# EAGLE board v.0.0.0 (EAGLE 5.11)
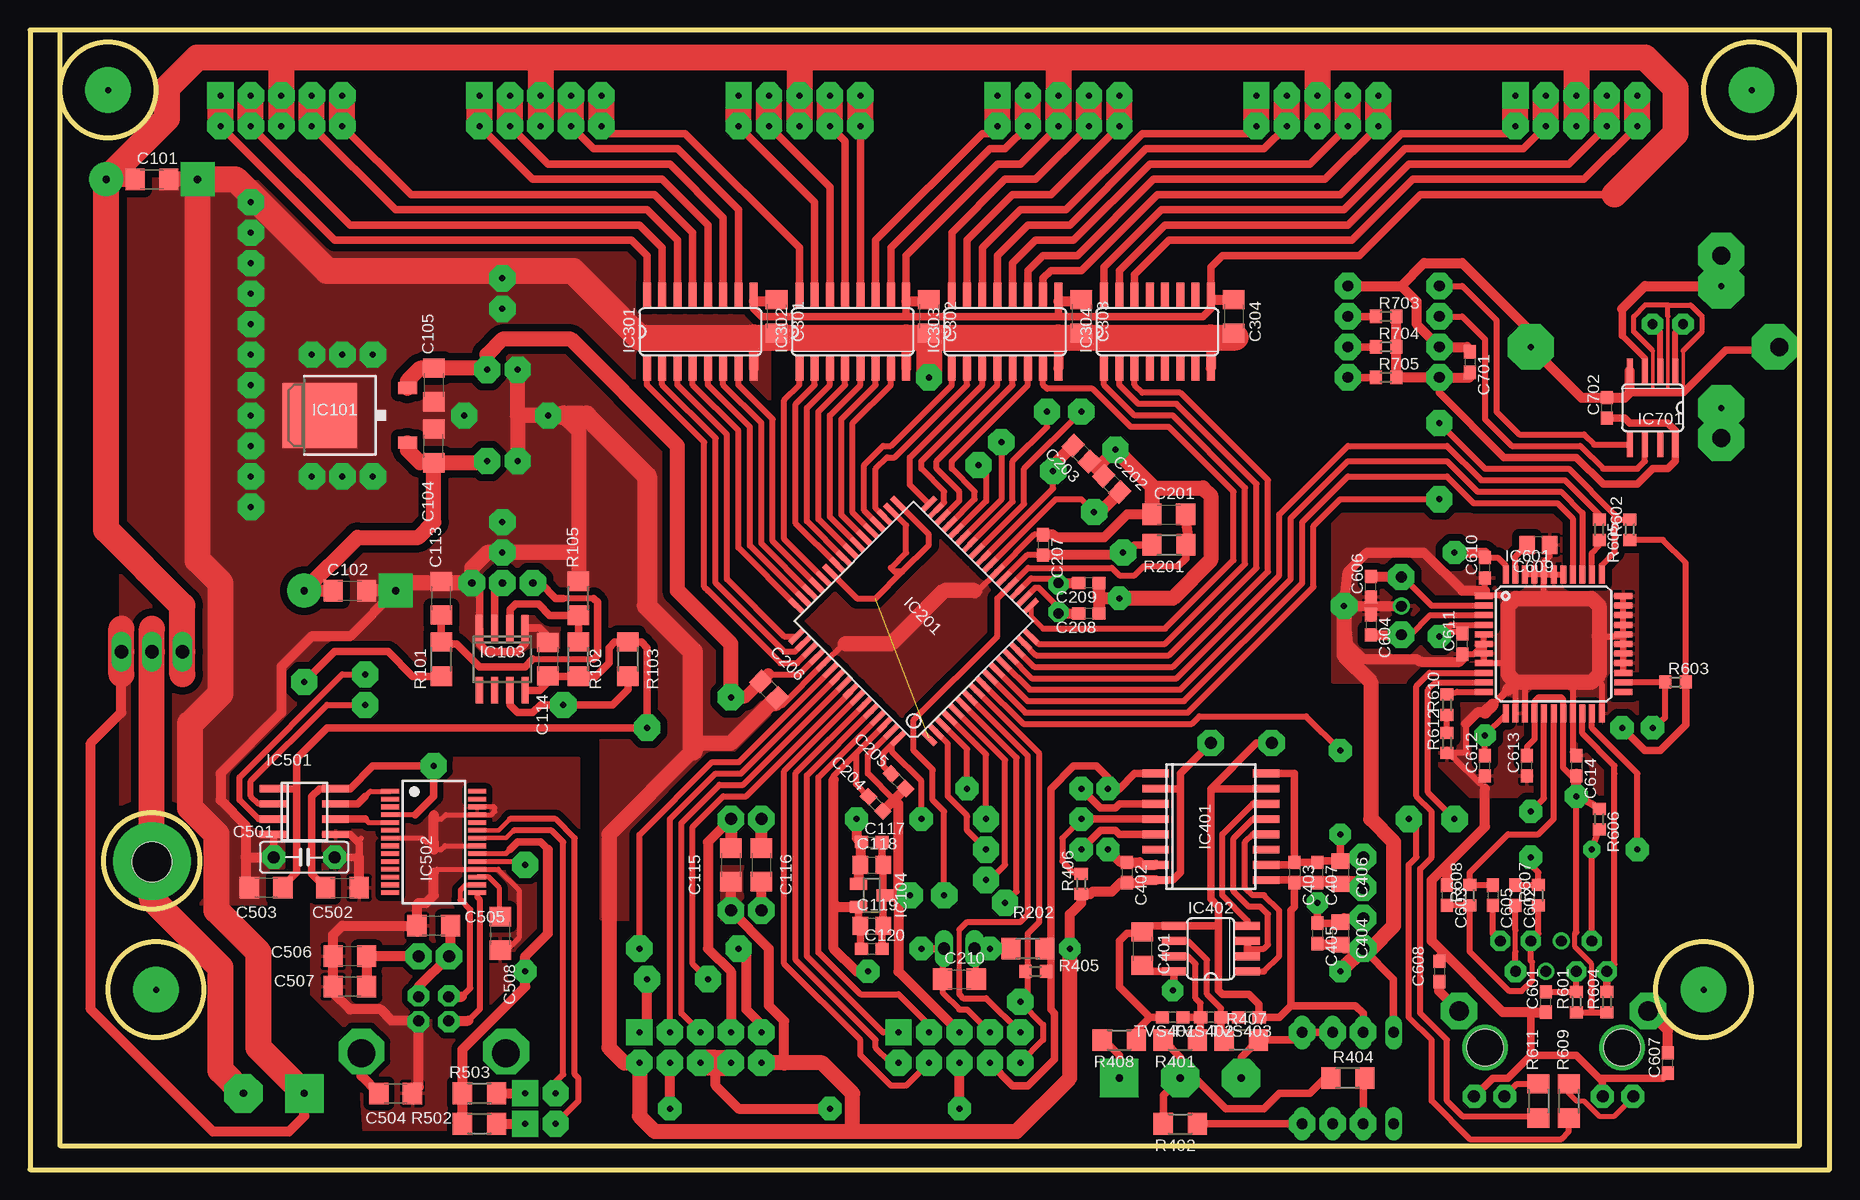
[diagram p7: board, top side]
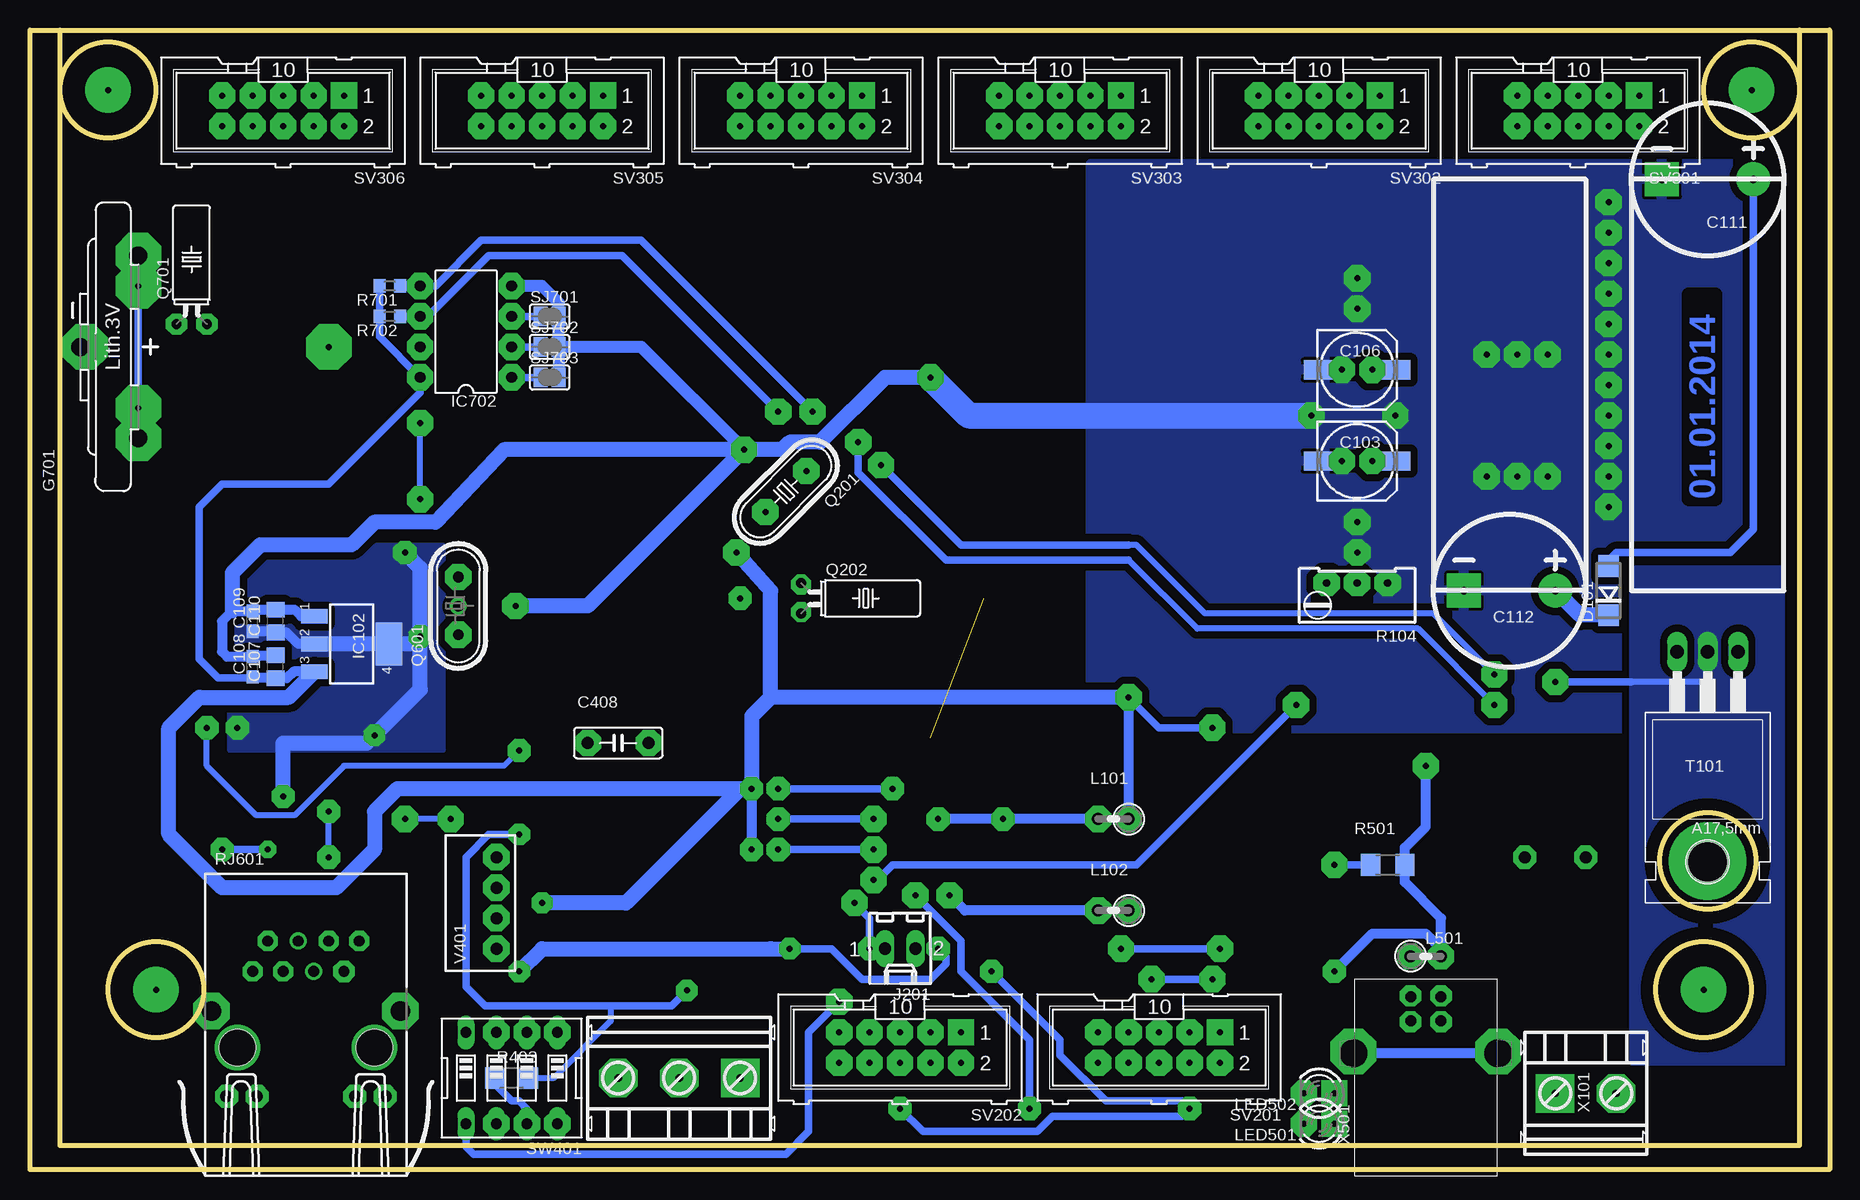
[diagram p8: board, bottom side, seen from below]

Size 150 x 95 mm. Coordinates in mm from the lower left corner, seen from the top.
Outline: 147.5,95 150,95 150,0 0,0 0,95 2.5,95
Outline: 147.5,95 2.5,95
Outline: 2.5,95 2.5,2 147.5,2 147.5,95
Outline: circle at 10.5,15 radius 4
Outline: circle at 139.5,15 radius 4
Outline: circle at 6.5,90 radius 4
Outline: circle at 143.5,90 radius 4
Outline: circle at 10.16,25.72 radius 4
Copper layers (1*16): Top 0.035mm / dielectric 1.5mm / Bottom 0.035mm
Design rules "default *": minimum track width 10mil, minimum drill 19mil, track to track 8mil, track to pad 8mil, pad to pad 8mil, via to via 8mil, smd to smd 8mil, copper to edge 40mil, drill to drill 8mil, minimum pad ring 10mil, minimum via ring 8mil, stop-mask expansion 4mil, vias tented up to drill 0mil, thermal gap 10mil
bRestrict: area 2,92 to 8,98; area 2,2 to 8,8

## Footprints (pad centres in the part's own frame; a part is rotated, then mirrored left to right if it is on the bottom)
C1206 = smd 1.6 x 1.8: 1 -1.4,0; 2 1.4,0
153CLV-0605 = smd 3.5 x 1.6: + 2.7,0; - -2.7,0
C0805 = smd 1.3 x 1.5: 1 -0.95,0; 2 0.95,0
C0603 = smd 1.1 x 1: 1 -0.85,0; 2 0.85,0
CP300X100X24 = drill 0.61 pad 2.819 round: + -3.81,0 | drill 0.61 pad 2.819 square: - 3.81,0
C050-025X075 = drill 1 octagon: 1 -2.54,0; 2 2.54,0
DO214AC = smd 1.8 x 1.7: A 2.05,0; C -2.05,0
CR2325/1VG = drill 1.5 pad 3.15 octagon: + 7.62,-1.27; +@1 -7.62,-1.27; - 0,3.556
TO252 = smd 1 x 1.6: 1 -2.28,-4.8; 2 2.28,-4.8 | smd 5.4 x 6.2: 3 0,2.5
SOT223 = smd 1.219 x 2.235: 1 -2.311,-3.099; 2 0,-3.099; 3 2.311,-3.099 | smd 3.6 x 2.2: 4 0,3.099
SO08 = smd 0.6 x 2.2: 1 -1.905,-2.6; 2 -0.635,-2.6; 3 0.635,-2.6; 4 1.905,-2.6; 5 1.905,2.6; 6 0.635,2.6; 7 -0.635,2.6; 8 -1.905,2.6
SOT23 = smd 1 x 1.4: 1 -0.95,-1.1; 2 0.95,-1.1; 3 0,1.1
TQFP64-HOME = smd 1.524 x 0.457: 1 -7.8,6; 2 -7.8,5.2; 3 -7.8,4.4; 4 -7.8,3.6; 5 -7.8,2.8; 6 -7.8,2; 7 -7.8,1.2; 8 -7.8,0.4; 9 -7.8,-0.4; 10 -7.8,-1.2; 11 -7.8,-2; 12 -7.8,-2.8; 13 -7.8,-3.6; 14 -7.8,-4.4; 15 -7.8,-5.2; 16 -7.8,-6; 33 7.8,-6; 34 7.8,-5.2; 35 7.8,-4.4; 36 7.8,-3.6; 37 7.8,-2.8; 38 7.8,-2; 39 7.8,-1.2; 40 7.8,-0.4; 41 7.8,0.4; 42 7.8,1.2; 43 7.8,2; 44 7.8,2.8; 45 7.8,3.6; 46 7.8,4.4; 47 7.8,5.2; 48 7.8,6 | smd 0.457 x 1.524: 17 -6,-7.8; 18 -5.2,-7.8; 19 -4.4,-7.8; 20 -3.6,-7.8; 21 -2.8,-7.8; 22 -2,-7.8; 23 -1.2,-7.8; 24 -0.4,-7.8; 25 0.4,-7.8; 26 1.2,-7.8; 27 2,-7.8; 28 2.8,-7.8; 29 3.6,-7.8; 30 4.4,-7.8; 31 5.2,-7.8; 32 6,-7.8; 49 6,7.8; 50 5.2,7.8; 51 4.4,7.8; 52 3.6,7.8; 53 2.8,7.8; 54 2,7.8; 55 1.2,7.8; 56 0.4,7.8; 57 -0.4,7.8; 58 -1.2,7.8; 59 -2,7.8; 60 -2.8,7.8; 61 -3.6,7.8; 62 -4.4,7.8; 63 -5.2,7.8; 64 -6,7.8
SO16 = smd 0.66 x 2.032: 1 -4.445,-3.073; 2 -3.175,-3.073; 3 -1.905,-3.073; 4 -0.635,-3.073; 5 0.635,-3.073; 6 1.905,-3.073; 7 3.175,-3.073; 8 4.445,-3.073; 9 4.445,3.073; 10 3.175,3.073; 11 1.905,3.073; 12 0.635,3.073; 13 -0.635,3.073; 14 -1.905,3.073; 15 -3.175,3.073; 16 -4.445,3.073
SO-16W = smd 0.635 x 2.2: 1 -4.445,-4.6; 2 -3.175,-4.6; 3 -1.905,-4.6; 4 -0.635,-4.6; 5 0.635,-4.6; 6 1.905,-4.6; 7 3.175,-4.6; 8 4.445,-4.6; 9 4.445,4.6; 10 3.175,4.6; 11 1.905,4.6; 12 0.635,4.6; 13 -0.635,4.6; 14 -1.905,4.6; 15 -3.175,4.6; 16 -4.445,4.6
SO08' = smd 0.66 x 2.032: 1 -1.905,-3.073; 2 -0.635,-3.073; 3 0.635,-3.073; 4 1.905,-3.073; 5 1.905,3.073; 6 0.635,3.073; 7 -0.635,3.073; 8 -1.905,3.073
SO8 = smd 0.6 x 2.2: 1 -1.905,-2.6; 2 -0.635,-2.6; 3 0.635,-2.6; 4 1.905,-2.6; 5 1.905,2.6; 6 0.635,2.6; 7 -0.635,2.6; 8 -1.905,2.6
SSOP28 = smd 0.381 x 1.499: 1 -4.225,-3.625; 2 -3.575,-3.625; 3 -2.925,-3.625; 4 -2.275,-3.625; 5 -1.625,-3.625; 6 -0.975,-3.625; 7 -0.325,-3.625; 8 0.325,-3.625; 9 0.975,-3.625; 10 1.625,-3.625; 11 2.275,-3.625; 12 2.925,-3.625; 13 3.575,-3.625; 14 4.225,-3.625; 15 4.225,3.625; 16 3.575,3.625; 17 2.925,3.625; 18 2.275,3.625; 19 1.625,3.625; 20 0.975,3.625; 21 0.325,3.625; 22 -0.325,3.625; 23 -0.975,3.625; 24 -1.625,3.625; 25 -2.275,3.625; 26 -2.925,3.625; 27 -3.575,3.625; 28 -4.225,3.625
TQFP44 = smd 1.5 x 0.5: 1 -5.8,4; 2 -5.8,3.2; 3 -5.8,2.4; 4 -5.8,1.6; 5 -5.8,0.8; 6 -5.8,0; 7 -5.8,-0.8; 8 -5.8,-1.6; 9 -5.8,-2.4; 10 -5.8,-3.2; 11 -5.8,-4; 23 5.8,-4; 24 5.8,-3.2; 25 5.8,-2.4; 26 5.8,-1.6; 27 5.8,-0.8; 28 5.8,0; 29 5.8,0.8; 30 5.8,1.6; 31 5.8,2.4; 32 5.8,3.2; 33 5.8,4 | smd 0.5 x 1.5: 12 -4,-5.8; 13 -3.2,-5.8; 14 -2.4,-5.8; 15 -1.6,-5.8; 16 -0.8,-5.8; 17 0,-5.8; 18 0.8,-5.8; 19 1.6,-5.8; 20 2.4,-5.8; 21 3.2,-5.8; 22 4,-5.8; 34 4,5.8; 35 3.2,5.8; 36 2.4,5.8; 37 1.6,5.8; 38 0.8,5.8; 39 0,5.8; 40 -0.8,5.8; 41 -1.6,5.8; 42 -2.4,5.8; 43 -3.2,5.8; 44 -4,5.8
SO8' = smd 0.508 x 2.032: 1 -1.905,-3.073; 2 -0.635,-3.073; 3 0.635,-3.073; 4 1.905,-3.073; 5 1.905,3.073; 6 0.635,3.073; 7 -0.635,3.073; 8 -1.905,3.073
DIL8-NEW = drill 0.9 pad 1.524 square: 1 -3.81,-3.81 | drill 0.9 pad 1.524 octagon: 2 -1.27,-3.81; 3 1.27,-3.81; 4 3.81,-3.81; 5 3.81,3.81; 6 1.27,3.81; 7 -1.27,3.81; 8 -3.81,3.81
6410-02 = drill 1.016 long: 1 1.27,0; 2 -1.27,0
0207/2V@1 = drill 1 octagon: 1 -1.27,0; 2 1.27,0
LED3MM-HOME = drill 0.5 pad 2.184 square: A -1.27,0 | drill 0.5 pad 2.184 octagon: K 1.27,0
HC49/S-HOME = drill 0.5 pad 2.184 octagon: 1 -2.413,0; 2 2.413,0
TC38H = drill 0.813 round: 1 -1.27,0; 2 1.27,0
HC49U = drill 0.9 round: 1 -2.413,0; 2 -0.027,0; 3 2.413,0
R1206 = smd 1.6 x 1.803: 1 -1.422,0; 2 1.422,0
RTRIM64W = drill 0.61 round: 1 1.27,-2.54; 2 1.27,0; 3 1.27,2.54
R0603 = smd 1 x 1.1: 1 -0.85,0; 2 0.85,0
TS8P8C = drill 0.9 round: 1 -4.445,6.35; 2 -3.175,8.89; 3 -1.905,6.35; 4 -0.635,8.89; 5 0.635,6.35; 6 1.905,8.89; 7 3.175,6.35; 8 4.445,8.89 | drill 1 round: 9 -6.63,-4.06; 10 -4.09,-4.06; 11 4.09,-4.06; 12 6.63,-4.06 | drill 1.6 round: M1 -7.875,3.05; M2 7.875,3.05 | hole 3: 5.715,0; -5.715,0
SJ = smd 1.168 x 1.6: 1 -0.762,0; 2 0.762,0
M10-HOME = drill 0.5 pad 2.184 square: 1 -5.08,-1.27 | drill 0.5 pad 2.184 octagon: 2 -5.08,1.27; 3 -2.54,-1.27; 4 -2.54,1.27; 5 0,-1.27; 6 0,1.27; 7 2.54,-1.27; 8 2.54,1.27; 9 5.08,-1.27; 10 5.08,1.27
EDG-04 = drill 0.9 long: 1 -3.81,-3.81; 2 -1.27,-3.81; 3 1.27,-3.81; 4 3.81,-3.81; 5 3.81,3.81; 6 1.27,3.81; 7 -1.27,3.81; 8 -3.81,3.81
TO220 = drill 1.118 long: 1 -2.54,-6.35; 2 0,-6.35; 3 2.54,-6.35 | hole 3.302: 0,11.176
D0603 = smd 1.1 x 1: 1 -0.85,0; 2 0.85,0
TME = drill 1 square: 1 -3.81,0 | drill 1 round: 2 -1.27,0; 3 1.27,0; 4 3.81,0
AWG/2-H = drill 0.61 pad 3.2 square: 1 2.54,0 | drill 0.61 pad 3.2 octagon: 2 -2.54,0
AWG/3-H = drill 0.61 pad 3.2 square: 1 5.08,0 | drill 0.61 pad 3.2 octagon: 2 0,0; 3 -5.08,0
85-32004-00X = drill 0.92 pad 1.27 round: 1 4.71,-1.25; 2 4.71,1.25; 3 2.71,1.25; 4 2.71,-1.25 | drill 2.3 pad 3 round: M1 0,6.02; M2 0,-6.02

## Placement (x,y rotation side)
C101  100nF  [C1206]  10.16,82.55 0 top
C102  100nF  [C1206]  26.67,48.26 0 top
C103  220uF/50V  [153CLV-0605]  39.37,59.05 0 bottom
C104  100nF  [C1206]  33.66,60.33 90 top
C105  100nF  [C1206]  33.66,65.41 270 top
C106  100uF/16V  [153CLV-0605]  39.37,66.67 0 bottom
C107  10uF  [C0805]  129.54,41.91 90 bottom
C108  100nF  [C0603]  131.44,41.91 90 bottom
C109  100nF  [C0603]  131.44,45.72 90 bottom
C110  10uF  [C0805]  129.54,45.72 90 bottom
C111  4700uF/25V  [CP300X100X24]  10.16,82.55 180 bottom
C112  4700uF/25V  [CP300X100X24]  26.67,48.26 180 bottom
C113  100nF  [C1206]  34.29,47.62 90 top
C114  100nF  [C1206]  43.18,42.55 270 top
C115  100nF  [C1206]  58.42,25.4 270 top
C116  100nF  [C1206]  60.96,25.4 270 top
C117  100nF  [C0603]  70.17,27.3 0 top
C118  10uF  [C0805]  70.17,25.4 0 top
C119  10uF  [C0805]  70.17,20.32 0 top
C120  100nF  [C0603]  70.17,18.41 0 top
C201  100nF  [C1206]  94.93,54.61 0 top
C202  22pF  [C0805]  90.17,57.15 315 top
C203  22pF  [C0805]  87.63,59.69 135 top
C204  100nF  [C0603]  70.48,30.48 135 top
C205  100nF  [C0603]  72.39,32.38 135 top
C206  100nF  [C0805]  61.59,40.01 135 top
C207  100nF  [C0603]  84.45,52.07 270 top
C208  NA  [C0603]  88.27,46.35 180 top
C209  NA  [C0603]  88.27,48.9 180 top
C210  100nF  [C1206]  77.47,15.88 0 top
C301  100nF  [C1206]  62.23,71.12 270 top
C302  100nF  [C1206]  74.93,71.12 270 top
C303  100nF  [C1206]  87.63,71.12 270 top
C304  100nF  [C1206]  100.33,71.12 270 top
C401  100nF  [C1206]  92.71,18.41 270 top
C402  100nF  [C0603]  91.44,24.77 270 top
C403  100nF  [C0603]  105.41,24.77 270 top
C404  4.7uF/16V  [C0805]  109.22,19.68 270 top
C405  100nF  [C0603]  107.31,19.68 270 top
C406  10uF  [C0805]  109.22,24.77 270 top
C407  100nF  [C0603]  107.31,24.77 270 top
C408  4.7nF/400V  [C050-025X075]  100.97,35.56 180 bottom
C501  4.7nF/400V  [C050-025X075]  22.86,26.04 0 top
C502  100nF  [C1206]  26.04,23.5 0 top
C503  100nF  [C1206]  19.68,23.5 180 top
C504  10nF  [C1206]  30.48,6.35 0 top
C505  10nF  [C1206]  33.66,20.32 180 top
C506  100nF  [C1206]  26.67,17.78 180 top
C507  4.7uF  [C1206]  26.67,15.24 180 top
C508  100nF  [C1206]  39.19,19.68 270 top
C601  10nF  [C0603]  126.36,13.97 90 top
C602  6.8nF  [C0603]  123.83,22.86 270 top
C603  10nF  [C0603]  118.11,22.86 270 top
C604  20pF  [C0603]  111.76,45.4 270 top
C605  6.8nF  [C0603]  121.92,22.86 270 top
C606  20pF  [C0603]  111.76,48.58 90 top
C607  10nF  [C0603]  136.53,8.89 90 top
C608  10nF  [C0603]  117.47,16.51 270 top
C609  10uF/6.3V  [C0805]  125.73,52.07 180 top
C610  100nF  [C0603]  121.28,50.16 90 top
C611  100nF  [C0603]  119.38,43.81 90 top
C612  100nF  [C0603]  121.28,33.66 90 top
C613  100nF  [C0603]  124.78,33.66 90 top
C614  100nF  [C0603]  128.91,33.66 270 top
C701  100nF  [C0603]  120.02,67.31 270 top
C702  100nF  [C0603]  131.44,63.5 90 top
D101  SS14  [DO214AC]  18.41,48.26 90 bottom
G701  CR2325/1VG  [CR2325/1VG]  142.24,68.58 90 bottom
IC101  7805TV  [TO252]  26.67,62.87 90 top
IC102  NX1117CE33Z  [SOT223]  123.19,43.81 270 bottom
IC103  LM311D  [SO08]  39.37,42.55 180 top
IC104  REF3040  [SOT23]  70.17,22.86 270 top
IC201  MEGA128-A  [TQFP64-HOME]  73.66,45.72 135 top
IC301  ULN2003AD  [SO16]  55.88,69.85 0 top
IC302  ULN2003AD  [SO16]  68.58,69.85 0 top
IC303  ULN2003AD  [SO16]  81.28,69.85 0 top
IC304  ULN2003AD  [SO16]  93.98,69.85 0 top
IC401  ADUM1301BRW  [SO-16W]  98.42,28.57 270 top
IC402  75176 or MAX485CSA  [SO08']  98.42,18.41 90 top
IC501  ADUM1201  [SO8]  22.86,29.84 270 top
IC502  FT232RL  [SSOP28]  33.66,27.3 270 top
IC601  ENC424J600-V00  [TQFP44]  127,43.81 0 top
IC701  DS1307ZN  [SO8']  135.25,63.5 180 top
IC702  24LC512-I/P  [DIL8-NEW]  113.67,69.85 90 bottom
J201  22-27-2021-02  [6410-02]  77.47,18.41 180 bottom
L101  68uH  [0207/2V@1]  59.69,29.21 180 bottom
L102  WIRE*  [0207/2V@1]  59.69,21.59 180 bottom
L501  CL22uH CECL  [0207/2V@1]  33.66,17.78 0 bottom
LED501  [LED3MM-HOME]  42.55,3.81 180 bottom
LED502  [LED3MM-HOME]  42.55,6.35 180 bottom
Q201  16.00 MHz  [HC49/S-HOME]  87,56.52 225 bottom
Q202  32.768 kHz  [TC38H]  85.72,47.62 270 bottom
Q601  25.00MHz  [HC49U]  114.3,46.99 90 bottom
Q701  [TC38H]  136.53,70.48 0 bottom
R101  10K  [R1206]  34.29,42.55 270 top
R102  1K  [R1206]  45.72,42.55 270 top
R103  1K  [R1206]  49.85,42.55 90 top
R104  5K  [RTRIM64W]  39.37,47.62 90 bottom
R105  1K  [R1206]  45.72,47.62 270 top
R201  1K  [R1206]  94.93,52.07 180 top
R202  1K  [R1206]  83.19,18.41 0 top
R401  10  [R1206]  95.89,10.79 180 top
R402  120  [R1206]  95.89,3.81 180 top
R403  560  [R1206]  109.86,7.62 0 bottom
R404  560  [R1206]  109.86,7.62 0 top
R405  5.6K  [R0603]  83.82,16.51 0 top
R406  5.6K  [R0603]  87.63,23.81 90 top
R407  10  [R1206]  100.97,10.79 0 top
R408  100  [R1206]  90.81,10.79 180 top
R501  10K  [R1206]  36.83,25.4 180 bottom
R502  360  [R1206]  37.47,3.81 0 top
R503  360  [R1206]  37.47,6.35 0 top
R601  10  [R0603]  128.91,13.97 90 top
R602  5.6K  [R0603]  133.35,53.34 90 top
R603  5.6K  [R0603]  137.16,40.64 0 top
R604  49.9  [R0603]  131.44,13.97 90 top
R605  100  [R0603]  130.81,53.34 270 top
R606  49.9  [R0603]  130.81,29.21 270 top
R607  49.9  [R0603]  125.73,22.86 90 top
R608  49.9  [R0603]  120.02,22.86 90 top
R609  200  [R1206]  128.27,5.71 90 top
R610  2.4K  [R0603]  118.11,38.73 90 top
R611  200  [R1206]  125.73,5.71 90 top
R612  10K  [R0603]  118.11,35.56 90 top
R701  1K  [R0603]  120.02,73.66 180 bottom
R702  1K  [R0603]  120.02,71.12 180 bottom
R703  5.6K  [R0603]  113.03,71.12 0 top
R704  5.6K  [R0603]  113.03,68.58 0 top
R705  5.6K  [R0603]  113.03,66.04 0 top
RJ601  TS8P8C  [TS8P8C]  127,10.16 0 bottom
SJ701  [SJ]  106.68,71.12 0 bottom
SJ702  [SJ]  106.68,68.58 0 bottom
SJ703  [SJ]  106.68,66.04 0 bottom
SV201  BH10S  [M10-HOME]  55.88,10.16 180 bottom
SV202  BH10S  [M10-HOME]  77.47,10.16 180 bottom
SV301  BH10S  [M10-HOME]  20.95,88.27 180 bottom
SV302  BH10S  [M10-HOME]  42.55,88.27 180 bottom
SV303  BH10S  [M10-HOME]  64.14,88.27 180 bottom
SV304  BH10S  [M10-HOME]  85.72,88.27 180 bottom
SV305  BH10S  [M10-HOME]  107.31,88.27 180 bottom
SV306  BH10S  [M10-HOME]  128.91,88.27 180 bottom
SW401  [EDG-04]  109.86,7.62 180 bottom
T101  IRF4905  [TO220]  10.16,36.83 180 bottom
TVS401  CDS3C09GTA  [D0603]  95.25,12.7 180 top
TVS402  CDS3C09GTA  [D0603]  98.42,12.7 180 top
TVS403  CDS3C09GTA  [D0603]  101.6,12.7 180 top
V401  AM1S-0505S-NZ  [TME]  111.12,22.23 90 bottom
X101  [AWG/2-H]  20.32,6.35 180 bottom
X401  [AWG/3-H]  95.89,7.62 0 bottom
X501  MINI-USB_SHIELD4P-85-32004-30X-1  [85-32004-00X]  33.66,9.69 90 bottom

## Tracks (layer width: path | path; a pad name or v marks a point on that pad's centre or on a via)
!CPU_CS_NET  (via drill 0.5 pad 2.18)
  Top 0.508: IC601.34 131,50.35 132.08,51.44 132.08,54.61 | v117.47,62.23 121.28,58.42 128.27,58.42 132.08,54.61 | IC201.10 82.98,38.1 96.52,38.1 107,48.58 107,53.66 109.22,55.88 v117.47,55.88 | R602.2 132.5,54.19 132.08,54.61
  Bottom 0.508: v117.47,55.88 v117.47,62.23
+3V3  (via drill 0.5 pad 1.78, 0.5 pad 1.93)
  Top 0.406: 130.18,15.75 130.18,17.14 128.78,18.54 128.78,19.68
  Top 0.508: IC601.4 118.44,45.41 v117.47,44.45 118.33,44.87 119.17,44.87 C611.2 | R603.2 138.01,50.59 136.1,52.49 R602.1 | IC601.44 123,50.35 122.34,51.02 C610.2 | 128.69,32.8 C614.2 | 128.69,32.8 128.49,32.8 127.8,33.49 IC601.18 127.8,39.2 127.64,39.37 125.73,39.37 125.4,39.04 125.4,38.73 IC601.15 125.4,35.87 124.78,35.24 C613.2 | 128.91,33.02 128.69,32.8 | R601.1 130.18,13.12 | 130.18,13.12 R604.1 | 130.18,13.12 130.18,15.75 | 128.78,19.68 128.91,19.81 v128.91,31.11 | IC601.12 123,37.91 v121.28,36.2 C612.2
  Top 0.61: R606.1 130.18,30.48 v128.91,31.11 | R603.2 138.01,37.05 135.89,34.92 134.62,34.92 v132.72,36.83
  Top 0.813: v118.75,51.44 121.28,51.44 C610.2 | v128.91,31.11 128.91,33.02
  Bottom 0.508: v117.47,44.45 117.47,43.81
  Bottom 0.813: C109.1 129.64,44.87 C110.1 128.59,44.77 127.64,43.81 IC102.2
  Bottom 1.27: v118.75,51.44 117.47,50.16 v117.47,44.45 117.47,40.01 121.92,35.56 128.91,35.56 v128.91,31.11 | IC102.2 IC102.4 117.47,43.81
  pour Bottom (isolate 0.61, no thermals): 115.57,34.92 133.35,34.92 133.35,52.07 115.57,52.07
+5V  (via drill 0.5 pad 1.78, 0.5 pad 1.93, 0.5 pad 2.18)
  Top 0.508: IC201.21 83.12,51.22 C207.2 | 85.09,18.41 R202.2 | IC201.52 64.12,41.27 61.52,41.27
  Top 0.61: IC401.1 92.08,33.02 90.81,31.75 v89.85,31.75 89.85,32.7 88.9,33.66 87,33.66 85.09,31.75 85.09,18.41 85.09,16.51 | C404.1 109.12,20.54 C405.1 v107.31,22.23 | C702.1 132.93,62.65 133.35,62.23 136.53,62.23 137.16,61.59 IC701.8 137.16,59.05 136.53,58.42 135.25,58.42 133.99,57.15 131.13,57.15 128.91,59.37 122.87,59.37 117.47,64.77 v117.47,66.04 | 85.09,16.51 85.09,13.34 85.41,13.02 85.41,9.21 83.19,6.99 81.92,6.99 SV202.8 | IC103.8 42.48,39.95 43.18,40.64 C114.2 43.2,41.12 R102.2 47.16,41.12 48.26,42.23 48.26,43.5 48.73,43.97 R103.2 50.97,43.97 51.44,43.5 v51.44,36.83 24.77,36.83 22.23,34.29 22.23,31.75 | R201.2 92.08,52.07 v91.12,51.44 | C503.1 21.09,23.62 22.23,24.77 22.23,31.75 | 22.23,31.75 IC501.1 | 85.09,16.51 R405.2
  Top 0.813: C701.2 120.02,66.04 v117.47,66.04 R705.2 R704.2 R703.2 | v111.12,20.95 109.54,20.95 C404.1 | IC401.7 92.71,25.4 92.5,25.61 C402.1 90.91,25.61 v89.85,26.67 | L101.1 56.52,27.3 56.52,18.41 58.42,16.51 SV201.7 | C207.2 91.22,51.22 v91.12,51.44
  Top 1.016: L101.1 C115.1 | 61.52,41.27 C206.2 59.62,39.37 v58.42,39.37
  Top 1.27: IC101.2 31.47,65.76 32.52,66.81 C105.1 37.97,66.81 v38.1,66.67 38.1,67.94 39.37,69.22 45.09,69.22 53.98,60.33 53.98,48.26 58.42,43.81 v58.42,39.37
  Bottom 0.61: R702.2 R701.2 120.86,69.43 v117.47,66.04 117.47,64.77 125.09,57.15 133.99,57.15 135.89,55.24 135.89,42.55 134.31,40.96 131.34,40.96 | v51.44,36.83 55.88,36.83 v58.42,39.37
  Bottom 0.813: v89.85,31.75 v89.85,26.67 | IC102.3 128.04,41.5 128.59,40.96 C107.1 131.34,40.96 C108.1 | v58.42,39.37 L101.1
  Bottom 1.27: IC102.3 128.42,39.37 135.89,39.37 138.43,36.83 138.43,27.94 133.99,23.5 124.46,23.5 121.28,26.67 121.28,29.84 119.38,31.75 90.81,31.75 | v38.1,66.67 C106.+ | v58.42,39.37 88.27,39.37 | 88.27,39.37 89.85,37.78 v89.85,31.75 90.81,31.75 | 90.81,31.75 100.33,22.23 v107.31,22.23 | 88.27,39.37 88.27,48.26 v91.12,51.44
  other vias: 58.42,29.21 58.42,29.21
+5V/1  (via drill 0.5 pad 1.93, 0.5 pad 2.18)
  Top 0.406: 32.12,29.58 IC502.4 | IC502.20 39.66,26.33 40.01,26.67
  Top 0.61: C502.1 23.5,24.64 23.5,31.11 24.13,31.75 IC501.8 26.67,31.75 28.57,33.66 v33.66,33.66 33.66,31.11 32.12,29.58 | 40.01,26.67 40.64,27.3 42.55,27.3 43.18,26.67
  Top 0.813: R502.1 R503.1 36.04,10.01 41.27,15.24 v41.27,16.51 41.27,17.78 43.18,19.68 43.18,26.67 | C507.1 C506.1 28.07,18.29 28.57,17.78 L501.2
  Bottom 0.813: 32.38,18.41 L501.2 | v41.27,16.51 38.1,19.68 33.66,19.68 32.38,18.41 | 32.38,18.41 32.38,20.95 35.41,23.98 R501.1 35.41,26.82 33.66,28.57 v33.66,33.66
  other vias: 32.38,17.78
+5V/2  (via drill 0.5 pad 1.78, 0.5 pad 2.18)
  Top 0.61: C401.2 93.22,16.51 IC402.8 95.35,15.34 v95.25,14.92 | IC401.16 105.41,33.02 C403.1 | IC401.10 105.19,25.4 C403.1 | V401.4 109.54,26.04 C406.1 | C406.1 107.42,25.71 C407.1 C403.1 | v109.22,27.94 C406.1
  Bottom 0.508: R403.2 106.36,7.62 101.6,12.38 101.6,13.65
  Bottom 0.61: v95.25,14.92 96.52,13.65 101.6,13.65 112.08,13.65 113.67,15.24 113.67,26.04 111.76,27.94 v109.22,27.94
  other vias: 111.12,26.04
ADC0
  Top 0.508: IC201.61 65.72,32.69 65.72,18.1 69.22,14.61 72.39,14.61 74.93,12.06 SV202.3
ADC1
  Top 0.508: SV202.1 71.12,11.43 64.77,17.78 64.77,32.87 IC201.60
ADC2
  Top 0.508: IC201.59 63.82,33.05 63.82,17.46 70.48,10.79 70.48,10.16 71.68,8.96 arc45 71.86,8.89 SV202.2
ADC3
  Top 0.508: IC201.58 62.87,33.23 62.87,17.14 69.22,10.79 69.22,9.53 71.75,6.99 73.03,6.99 SV202.4
AGND  (via drill 0.5 pad 2.18)
  Top 0.508: 71.12,22.71 IC104.3 71.12,23.01 | C118.2 71.02,25.5 | IC201.63 69.85,34.56 69.85,33.02 72.04,30.83
  Top 0.61: C120.2 71.02,20.22 C119.2 71.12,22.71 | 71.02,25.5 C117.2 | 71.12,23.01 C118.2
  Top 0.813: SV202.5 72.39,16.51 72.39,22.86 | v73.34,22.86 72.39,22.86 | 72.39,22.86 72.39,29.84 72.39,30.48 | 72.39,30.48 arc67 72.39,30.48 | 72.39,30.48 72.04,30.83 | 72.04,30.83 C204.1 | 72.04,30.83 | 72.04,30.83 C205.1 | 72.39,22.86 IC104.3 | L102.2 C116.2
  Bottom 0.813: v73.34,22.86 72.07,21.59 L102.2
  other vias: 60.96,21.59
AREF  (via drill 0.5 pad 1.93)
  Top 0.406: C204.2
  Top 0.508: 66.99,32.38 66.99,32.51 66.99,32.83 68.83,34.67 | 68.83,34.67 IC201.62 | 69.07,20.47 C119.1 | 69.22,18.52 C120.1 | C204.2 68.83,32.13 68.83,34.67
  Top 0.61: IC104.2 69.07,20.47 | C119.1 69.22,18.52
  Top 0.813: v53.34,5.08 SV201.4 | IC104.2 67.31,21.91 66.99,22.23 | 66.99,22.23 66.99,32.51 | 66.99,22.23 66.99,18.41 68.9,16.51 v69.85,16.51 | v77.47,5.08 SV202.6
  Bottom 0.61: v77.47,5.08 75.56,3.17 66.04,3.17 64.77,4.45 53.98,4.45 v53.34,5.08 53.98,5.71 60.33,5.71 64.14,9.53 64.14,10.79 v69.85,16.51
AVCC  (via drill 0.5 pad 1.93, 0.5 pad 2.18)
  Top 0.508: C118.1 69.07,25.25 | v74.3,29.21 74.3,32.38 71.87,34.81 71.87,35.45 | C205.2 71.12,33.66 71.12,34.7 71.87,35.45 | C205.2 | 71.87,35.45 IC201.64 | v68.9,29.21 69,29
  Top 0.61: C117.1 69.22,27.2 | 69,29 68.9,29
  Top 0.813: 69.07,25.25 IC104.1 | 69.22,27.2 C118.1 | 68.9,29 68.9,27.62 C117.1
  Top 1.016: C116.1 L101.2
  Bottom 0.813: v74.3,29.21 v68.9,29.21 L101.2
  other vias: 60.96,29.21
BUS+  (via drill 0.5 pad 2.18)
  Top 0.61: X401.3 100.97,9.37 R407.2 105.41,10.79 SW401.1 v108.58,11.43
  other vias: 106.05,11.43
BUS-
  Top 0.61: X401.2 95.89,9.37 R401.2 | X401.2 97.16,7.62 99.69,5.08 102.87,5.08 104.14,6.35 106.68,6.35 107.95,7.62 R404.1 | R402.2 94.46,6.2 X401.2
CPU_MISO
  Top 0.508: R605.1 130.81,54.61 127.95,57.47 120.97,57.47 118.11,60.33 109.86,60.33 104.14,54.61 104.14,49.53 95.57,40.96 83.51,40.96 IC201.13
CPU_MOSI
  Top 0.508: IC601.36 129.4,54.75 127.64,56.52 120.65,56.52 118.11,59.05 109.86,59.05 105.09,54.29 105.09,49.21 95.89,40.01 83.33,40.01 IC201.12
CPU_NET_INT  (via drill 0.5 pad 1.93)
  Top 0.508: IC601.24 136.28,40.62 R603.1 136.31,37.68 v135.25,36.83 | IC201.9 82.8,37.15 96.84,37.15 97.47,37.78 106.36,37.78 v109.22,34.92
  Bottom 0.508: v109.22,34.92 110.49,33.66 123.83,33.66 127.95,29.53 131.13,29.53 135.25,33.66 v135.25,36.83
CPU_SCK
  Top 0.508: IC601.37 128.6,54.28 127.32,55.56 120.33,55.56 118.11,57.78 109.86,57.78 106.05,53.98 106.05,48.9 96.2,39.05 83.16,39.05 IC201.11
CPU_SCL  (via drill 0.5 pad 2.18)
  Top 0.508: IC701.6 134.62,59.05 133.99,58.42 131.13,58.42 129.22,60.33 123.51,60.33 121.28,62.55 121.28,69.22 119.38,71.12 v117.47,71.12 | IC201.25 82.87,55.49 82.87,58.42 v87.63,63.18
  Bottom 0.61: R702.1 v117.47,71.12 116.84,71.12 111.76,76.2 100.65,76.2 v87.63,63.18
CPU_SDA  (via drill 0.5 pad 2.18)
  Top 0.508: IC701.5 130.39,60.43 129.54,61.28 124.14,61.28 122.24,63.18 122.24,70.8 119.38,73.66 v117.47,73.66 | IC201.26 81.92,55.67 81.92,59.05 84.77,61.91 v84.77,63.18
  Bottom 0.61: v84.77,63.18 99.06,77.47 112.39,77.47 116.2,73.66 v117.47,73.66
  Bottom 0.813: v117.47,73.66 R701.1
GND  (via drill 0.5 pad 1.42, 0.5 pad 1.78, 0.5 pad 1.93, 0.5 pad 2.18, 0.5 pad 3.81)
  Top 0.305: 135.25,68.26 135.25,64.77 136.53,64.77 136.53,71.12 | 137.79,64.77 137.79,68.26
  Top 0.406: 135.25,68.26 133.67,69.85 133.67,71.12 134.62,72.07 136.53,72.07 | 136.53,72.07 138.43,72.07 139.38,71.12 139.38,69.85 137.79,68.26 | 136.53,71.12 136.53,72.07
  Top 0.508: IC601.40 IC601.41 IC601.42 IC601.40 | IC601.40 IC601.39 IC601.38 | IC601.8 IC601.7 IC601.6 | IC601.6 IC601.5 | IC601.8 121.2,43.73 121.28,43.81 | IC601.40 126.28,49.62 | 132.27,47.81 IC601.33 IC601.32 IC601.31 IC601.30 IC601.29 IC601.28 IC601.27 IC601.26 IC601.25 132.8,44.37 132.72,44.45 130.81,44.45 | 121.28,47.9 121.28,48.26 C610.1 | 121.28,47.9 IC601.1 | IC601.8 122.89,42.22 123.19,41.91 | IC601.40 126.2,47.79 126.36,47.62 | 121.28,47.9 122.92,47.9 123.51,47.31 | 128.91,40.64 128.6,40.34 IC601.19 128.6,34.81 C614.1 | IC601.22 131,40.45 130.49,40.96 | C609.1 126.68,51.12 126.2,50.63 IC601.40 | C611.1 120.35,42.97 IC601.6 | C207.1 83.69,52.92 IC201.22 79.03,48.26 78.74,48.26 | 67.94,43.81 67.8,43.81 IC201.53 62.68,38.7 C206.1 | C612.1 120.86,32.17 118.75,34.29 R612.1 119.8,34.71 119.7,34.92 119.7,37.15 | 122.56,39.37 121.92,38.73 | IC601.14 124.6,40.5 124.46,40.64 123.83,40.64 123.8,40.62 IC601.13 | SV202.7 78.11,13.34 77.47,13.34 76.07,14.73 C210.1 76.07,18.29 J201.2 | C302.2 74.93,69.22 | 88.9,58.42
  Top 0.61: 87.63,69.37 C303.2 | 74.93,69.37 C302.2 | C301.2 62.39,69.56 62.39,69.37 | 100.33,69.37 C304.2 | IC401.8 95.25,24.13 95.89,24.77 95.89,31.75 | 95.89,31.75 IC401.2 | 107.42,18.73 C405.2 | 133.35,64.77 136.53,64.77 137.79,64.77 141.35,68.33 145.8,68.33 G701.- | C408.1 95.89,33.02 95.89,31.75 | 123.19,40.01 122.56,39.37 | R104.1 37.47,48.26 IC103.4 37.47,43.81 38.1,43.18 40.64,43.18 41.27,43.81 IC103.1 42.48,45.15 43.18,44.45 C114.1 | C501.1 20.32,27.88 IC501.4 | v74.3,18.41 J201.2 | v86.68,18.41 86.36,18.41 | SW401.4 113.67,15.88 v111.12,18.41 | C608.1 117.47,17.78 117.79,18.1 | v120.4,6.1 121.92,7.62 123.19,7.62 125.09,9.53 | 125.09,9.53 125.09,13.12 | 125.09,9.53 128.91,9.53 130.81,7.62 | 130.81,7.62 136.1,7.62 C607.1 | 130.81,7.62 131.06,7.37 v131.06,6.1 v131.07,6.1 RJ601.10
  Top 0.813: 60.33,69.37 IC301.8 | 85.72,69.37 IC303.8 | 73.03,69.37 IC302.8 | 98.42,69.37 IC304.8 | C503.2 18.1,23.81 17.97,23.94 17.97,26.04 | 17.97,26.04 C501.1 | 7.62,41.27 7.62,38.1 5.08,35.56 5.08,13.34 15.24,3.17 21.59,3.17 22.86,4.45 X101.1 | C701.1 119.8,68.58 v117.47,68.58 115.57,70.48 115.57,72.39 114.3,73.66 | IC701.4 133.35,64.77 132.93,64.35 C702.2 129.32,64.35 v125.09,68.58 125.09,69.85 119.38,75.56 116.2,75.56 114.3,73.66 | IC702.4 114.3,73.66 | C203.1 C202.1 88.9,58.42 | C207.1 85.31,52.92 85.52,52.7 89.53,52.7 91.44,54.61 C201.1 | v109.54,46.99 109.86,43.81 111.12,42.55 115.57,42.55 115.99,42.33 119.17,42.33 119.38,42.55 C611.1 | v109.54,46.99 109.86,49.85 111.44,51.44 116.2,51.44 119.38,48.26 121.28,48.26 | 111.76,46.99 C604.1 | 111.76,46.99 C606.1 | Q601.2 111.79,46.96 111.76,46.99 | v109.54,46.99 111.76,46.99 | 107.42,18.73 C404.2 109.54,18.41 v111.12,18.41 | 121.28,38.1 120.65,38.1 119.7,37.15 | v86.68,18.41 86.68,21.27 87.63,22.23 R406.1 88.37,22.96 88.58,23.18 90.17,23.18 90.91,23.91 C402.2 92.5,23.91 92.71,24.13 IC401.8 | C206.1 62.26,38.77 | 118.11,25.4 C603.1 | 118.11,25.4 121.28,28.57 121.28,31.75 | C601.1 125.09,13.12 122.77,13.12 117.79,18.1 116.84,19.05 116.84,24.13 118.11,25.4 | 62.87,8.89 62.87,12.38 61.59,13.65 61.59,18.41 L102.1 C115.2 | 17.97,26.04 17.97,28.7 15.88,30.8 15.88,33.02 20.95,38.1 20.95,41.91 23.5,44.45 26.67,44.45 C112.- | v120.4,6.1 RJ601.12
  Top 1.016: 89.11,47.62 C208.1 | 89.11,47.62 C209.1 89.11,48.05 | v90.81,47.62 89.11,47.62 | 61.59,38.73 62.23,38.73 | 123.83,40.64 123.19,40.01 | 121.92,38.73 121.28,38.1 | v90.49,60.01 88.9,58.42 | C112.- C102.2
  Top 1.27: 68.58,3.17 68.58,6.35 66.04,8.89 62.87,8.89 SV201.10 | 67.94,43.81 71.75,43.81 76.2,48.26 78.74,48.26 | 40.64,62.87 v40.64,66.67 | 68.58,3.17 82.23,3.17 86.68,7.62 v86.68,18.41 | v109.54,46.99 109.54,42.86 111.76,40.64 111.76,29.21 113.67,27.3 113.67,20.32 111.76,18.41 v111.12,18.41 v109.22,16.51 | 68.58,3.17 52.07,3.17 50.8,4.45 SV201.2 49.53,8.89 48.26,10.16 48.26,27.94 55.24,34.92 55.88,35.56 58.42,35.56 61.59,38.73 | 14.61,82.55 C101.2 | C112.- 31.11,48.9 34.92,48.9 | 34.92,48.9 R104.1 36.83,50.16 38.1,51.44 v39.37,51.44 45.72,51.44 | 34.92,48.9 C113.2 | 40.64,62.87 v40.64,59.05 | 40.64,62.87 v43.18,62.87 44.45,62.87 45.72,61.59 45.72,51.44 | 45.72,51.44 R105.1 | v90.81,47.62 95.25,47.62 98.42,50.8 98.42,56.2 97.79,56.83 93.66,56.83 93.53,56.96 | 93.53,56.96 C201.1 | v90.49,60.01 93.53,56.96 | 130.18,47.62 130.81,46.99 130.81,44.45 130.81,41.27 130.49,40.96 130.18,40.64 128.91,40.64 123.83,40.64 123.19,41.27 123.19,41.91 123.19,46.99 123.51,47.31 123.83,47.62 126.36,47.62 130.18,47.62
  Top 1.676: 55.24,34.92 55.24,43.18 51.44,46.99 51.44,57.78 46.35,62.87 44.45,62.87
  Top 2.184: 74.93,69.22 v74.93,66.04 | 7.62,41.27 T101.1 7.62,45.09 | X101.1 19.05,10.16 19.05,18.1 15.56,21.59 15.56,27.94 13.34,30.16 13.34,37.15 15.88,39.69 15.88,48.9 13.97,50.8 C111.- 14.61,82.55 17.14,82.55 24.77,74.93 45.24,74.93 50.8,69.37 60.33,69.37 62.39,69.37 73.03,69.37 74.93,69.37 85.72,69.37 87.63,69.37 98.42,69.37 100.33,69.37 100.49,69.37
  Bottom 0.61: v74.3,18.41 73.66,17.78 73.66,17.14 74.93,15.88 80.64,15.88 83.19,18.41 88.27,18.41
  Bottom 0.813: IC102.1 127.41,46.13 127.95,46.67 C110.2 131.34,46.67 C109.2 133.13,46.57 133.99,45.72 133.99,43.18 133.56,42.76 C108.2 131.34,42.86 C107.2
  Bottom 1.016: SJ702.2 SJ703.2 | SJ702.2 SJ701.2 105.92,72.26 107.31,73.66 IC702.4 | SJ702.2 99.06,68.58 v90.49,60.01
  Bottom 1.27: v40.64,59.05 C103.- | v40.64,66.67 C106.- | v86.68,18.41 88.27,18.41 107.31,18.41 v109.22,16.51 | 133.13,46.57 133.13,49.74 130.81,52.07 123.19,52.07 121.28,53.98 116.2,53.98 110.49,60.01 v90.49,60.01 | v90.49,60.01 103.5,46.99 v109.54,46.99 | v74.93,66.04 78.74,66.04 84.14,60.64 86.68,60.64 87.31,60.01 v90.49,60.01
  Bottom 2.184: v43.18,62.87 71.75,62.87 v74.93,66.04
  other vias: 18.41,62.87 18.41,65.41 18.41,67.94 18.41,70.48 18.41,73.03 18.41,75.56 18.41,78.11 18.41,80.64 18.41,57.78 18.41,60.33 76.2,18.41 20.32,26.04 109.86,73.66 36.83,48.9 58.42,21.59 98.42,35.56 18.41,55.24 39.37,53.98 39.37,71.75 39.37,74.3 36.2,62.87 23.5,57.78 23.5,57.78 26.04,57.78 28.57,57.78 23.5,67.94 26.04,67.94 28.57,67.94
  pour Top (isolate 0.61, no thermals): 20.32,71.12 20.32,54.61 44.45,54.61 44.45,71.12
  pour Top (isolate 0.61, no thermals): 7.62,82.55 7.62,22.23 21.59,22.23 22.23,22.86 22.23,34.29 24.77,36.83 46.99,36.83 47.62,36.2 47.62,20.95 61.59,20.95 61.59,81.28
  pour Top (isolate 0.61): 108.58,54.61 108.58,40.64 114.94,40.64 115.57,40.01 115.57,35.56 120.02,31.11 133.99,31.11 133.99,54.61
  pour Top (isolate 0.61): 63.5,45.72 73.66,55.88 83.82,45.72 74.3,36.2 73.03,36.2
  pour Bottom (isolate 0.61, rank 2): 0,36.83 0,83.82 61.59,83.82 61.59,36.83
GND1  (via drill 0.5 pad 1.78, 0.5 pad 1.93)
  Top 0.406: IC502.18 37.2,25.03 | 37.22,30.23 IC502.26 38.67,30.23 38.73,30.16 38.73,29.84 38.47,29.58 IC502.25 34.66,29.58 34.29,29.21 33.66,29.21 | 37.16,26.98 IC502.21 34.6,26.98 34.29,26.67 33.66,26.67 | IC502.18 33.92,25.03 33.66,24.77 | IC502.18 39.03,25.03 40.77,23.29 40.77,19.33 39.72,18.29 C508.2 | 33.66,27.3 33.02,27.3 32.7,27.63 IC502.7 | 26.67,27.94 26.98,27.63 | 27.3,27.3 27.63,27.63
  Top 0.61: IC501.5 26.67,27.94 27.3,27.3 27.43,27.18 27.43,26.04 C501.2
  Top 0.813: 33.66,26.67 33.66,27.3 33.66,29.21 33.66,29.55 | C504.2 32.41,6.88 X501.4 30.14,12.4 29.21,13.34 26.67,13.34 25.27,14.73 C507.2 C506.2 25.27,19.55 26.04,20.32 C505.2 32.26,22.09 32.38,22.23 33.02,22.23 33.66,22.86 33.66,24.77 | C502.2 27.43,26.04
  other vias: 25.4,26.04 32.38,12.32
  pour Top (isolate 0.508): 27.94,1.91 45.72,1.91 45.72,34.29 23.5,34.29 23.5,14.61 27.3,10.79
GND2  (via drill 0.5 pad 2.18)
  Top 0.61: 99.06,20.32 99.06,14.92 99.38,14.61 101.6,14.61 102.45,13.76 TVS403.1 104.14,12.7 105.09,13.65 | 99.06,20.32 IC402.5 93.22,20.32 C401.1 92.58,19.68 91.44,19.68 90.81,19.05 90.81,15.24 93.34,12.7 | R408.1 92.23,11.58 93.34,12.7 | SW401.3 111.12,13.02 110.49,13.65 105.09,13.65 | C403.2 105.19,24.13 IC401.9 111.12,24.13 | C403.2 C407.2 109.12,23.91 C406.2 110.81,23.82 V401.3 | 99.06,20.32 99.06,21.91 98.42,22.54 98.42,31.75 | 98.42,31.75 IC401.15 | 93.34,12.7 TVS401.2 | 105.09,13.65 105.09,21.59 105.41,21.91 105.41,22.23 105.41,22.86 C403.2 | v103.5,35.56 102.23,35.56 98.42,31.75
  other vias: 111.12,11.43 111.12,23.5
M11
  Top 0.61: IC301.16 51.44,76.2 50.16,77.47 25.4,77.47 SV301.2
  Top 2.184: SV301.2 SV301.1
M12
  Top 0.61: IC301.15 52.7,76.83 50.8,78.74 26.67,78.74 SV301.4
  Top 2.184: SV301.4 SV301.3
M13
  Top 0.61: IC301.14 53.98,77.47 51.44,80.01 30.48,80.01 SV301.8
  Top 2.184: SV301.8 SV301.7
M14
  Top 0.61: IC301.13 55.24,78.11 52.07,81.28 31.75,81.28 SV301.10
  Top 2.184: SV301.10 SV301.9
M21
  Top 0.61: IC301.12 56.52,78.74 52.7,82.55 41.91,82.55 SV302.2
  Top 2.184: SV302.2 SV302.1
M22
  Top 0.61: IC301.11 57.78,79.38 53.34,83.82 43.18,83.82 SV302.4
  Top 2.184: SV302.4 SV302.3
M23
  Top 0.61: IC301.10 59.05,80.01 53.98,85.09 46.99,85.09 SV302.8
  Top 2.184: SV302.8 SV302.7
M24
  Top 0.61: SV302.10 48.26,86.36 54.61,86.36 64.14,76.83 IC302.16
  Top 2.184: SV302.10 SV302.9
M31
  Top 0.61: IC302.15 65.41,80.64 SV303.2
  Top 2.184: SV303.2 SV303.1
M32
  Top 0.61: IC302.14 66.67,81.92 SV303.4
  Top 2.184: SV303.4 SV303.3
M33
  Top 0.61: IC302.13 67.94,85.72 SV303.8
  Top 2.184: SV303.8 SV303.7
M34
  Top 0.61: IC302.12 SV303.10
  Top 2.184: SV303.10 SV303.9
M41
  Top 0.61: IC302.11 70.48,77.47 79.38,86.36 80.01,86.36 SV304.2
  Top 2.184: SV304.2 SV304.1
M42
  Top 0.61: IC302.10 71.75,76.83 80.01,85.09 81.28,85.09 SV304.4
  Top 2.184: SV304.4 SV304.3
M43
  Top 0.61: IC303.16 76.83,78.11 81.28,82.55 83.82,82.55 SV304.8
  Top 2.184: SV304.8 SV304.7
M44
  Top 0.61: IC303.15 78.11,77.47 81.92,81.28 85.09,81.28 SV304.10
  Top 2.184: SV304.10 SV304.9
M51
  Top 0.61: IC303.14 79.38,76.83 82.55,80.01 86.36,80.01 92.71,86.36 101.6,86.36 SV305.2
  Top 2.184: SV305.2 SV305.1
M52
  Top 0.61: IC303.13 80.64,76.2 83.19,78.74 86.68,78.74 93.03,85.09 102.87,85.09 SV305.4
  Top 2.184: SV305.4 SV305.3
M53
  Top 0.61: IC303.12 81.92,75.56 83.82,77.47 87,77.47 93.34,83.82 106.68,83.82 SV305.8
  Top 2.184: SV305.8 SV305.7
M54
  Top 0.61: IC303.11 83.19,74.93 84.45,76.2 87.31,76.2 93.66,82.55 107.95,82.55 SV305.10
  Top 2.184: SV305.10 SV305.9
M61
  Top 0.61: IC303.10 84.45,74.3 85.09,74.93 87.63,74.93 93.98,81.28 109.22,81.28 114.3,86.36 123.19,86.36 SV306.2
  Top 2.184: SV306.2 SV306.1
M62
  Top 0.61: IC304.16 89.53,75.25 94.3,80.01 109.54,80.01 114.62,85.09 124.46,85.09 SV306.4
  Top 2.184: SV306.4 SV306.3
M63
  Top 0.61: IC304.15 90.81,74.93 94.61,78.74 109.86,78.74 114.94,83.82 128.27,83.82 SV306.8
  Top 2.184: SV306.8 SV306.7
M64
  Top 0.61: IC304.14 92.08,74.61 94.93,77.47 110.17,77.47 115.25,82.55 129.54,82.55 SV306.10
  Top 2.184: SV306.10 SV306.9
MCU_M11
  Top 0.508: IC201.51 63.95,42.23 62.55,42.23 56.52,48.26 | 56.52,48.26 | 56.52,48.26 56.2,48.58 56.2,60.64 51.44,65.41 IC301.1
MCU_M12
  Top 0.508: IC201.50 63.77,43.18 62.87,43.18 57.15,48.9 57.15,60.96 52.7,65.41 IC301.2
MCU_M13
  Top 0.508: IC201.49 62.87,44.45 58.1,49.21 58.1,61.28 53.98,65.41 IC301.3
MCU_M14
  Top 0.508: IC201.48 59.05,51.84 59.05,61.59 55.24,65.41 IC301.4
MCU_M21
  Top 0.508: IC201.47 60.01,52.02 60.01,61.91 56.52,65.41 IC301.5
MCU_M22
  Top 0.508: IC201.46 60.96,52.2 60.96,62.23 57.78,65.41 IC301.6
MCU_M23
  Top 0.508: IC201.45 63.49,50.8 63.49,50.81 61.91,52.39 61.91,62.55 59.05,65.41 IC301.7
MCU_M24
  Top 0.508: IC302.1 64.14,65.41 62.87,64.14 62.87,52.55 IC201.44
MCU_M31
  Top 0.508: IC201.42 63.82,53.87 63.82,63.82 65.41,65.41 IC302.2
MCU_M32
  Top 0.508: IC201.41 64.77,54.04 64.77,63.5 66.67,65.41 IC302.3
MCU_M33
  Top 0.508: IC201.40 65.72,54.22 65.72,63.18 67.94,65.41 IC302.4
MCU_M34
  Top 0.508: IC201.39 66.67,54.4 66.67,62.87 69.22,65.41 IC302.5
MCU_M41
  Top 0.508: IC201.38 67.63,54.58 67.63,62.55 70.48,65.41 IC302.6
MCU_M42
  Top 0.508: IC201.37 68.58,54.76 68.58,62.23 71.75,65.41 IC302.7
MCU_M43
  Top 0.508: IC303.1 76.83,65.41 71.75,60.33 71.12,60.33 69.53,58.74 69.53,54.94 IC201.36
MCU_M44
  Top 0.508: IC303.2 78.11,65.41 72.07,59.37 71.44,59.37 70.48,58.42 70.48,55.12 IC201.35
MCU_M51
  Top 0.508: IC303.3 79.38,65.41 73.34,59.37 73.34,57.07 IC201.32
MCU_M52
  Top 0.508: IC303.4 80.64,65.41 74.3,59.05 74.3,58.42 76.2,56.52 76.2,55.61 IC201.31
MCU_M53
  Top 0.508: IC303.5 81.92,65.41 75.56,59.05 75.56,58.42 77.47,56.52 77.47,55.75 IC201.30
MCU_M54
  Top 0.508: IC303.6 83.19,65.41 76.83,59.05 76.83,58.42 78.74,56.52 78.74,55.89 IC201.29
MCU_M61
  Top 0.406: IC201.17 83.42,46.12 84.45,45.09
  Top 0.508: 84.45,45.09 94.61,45.09 100.33,50.8 100.33,56.52 94.93,61.91 91.76,61.91 88.58,65.09 84.77,65.09 84.45,65.41 IC303.7
MCU_M62
  Top 0.508: IC201.16 84.05,43.81 94.61,43.81 101.28,50.48 101.28,56.83 95.25,62.87 92.08,62.87 89.53,65.41 IC304.1
MCU_M63
  Top 0.508: IC201.15 83.87,42.86 94.93,42.86 102.23,50.16 102.23,57.15 95.57,63.82 92.39,63.82 90.81,65.41 IC304.2
MCU_M64
  Top 0.508: IC201.14 83.69,41.91 95.25,41.91 103.19,49.85 103.19,57.47 95.89,64.77 92.71,64.77 92.08,65.41 IC304.3
N$1  (via drill 0.5 pad 3.81)
  other vias: 145.41,68.58
N$2  (via drill 0.5 pad 2.18, 0.5 pad 6.45)
  Top 0.61: R101.2 31.9,41.12 29.84,43.18 25.4,43.18 v22.86,40.64
  Top 2.184: 10.16,45.09 T101.2 v10.16,25.72 10.16,22.54 15.88,16.83 15.88,8.26 X101.2
  Bottom 0.508: 16.51,40.64 10.16,40.64 T101.2
  Bottom 0.61: 16.51,40.64 v22.86,40.64
  pour Bottom (isolate 0.61, no thermals): 2.54,50.16 16.51,50.16 16.51,8.89 1.91,8.89 arc3
  pour Bottom: 13.34,22.86 6.99,22.86 6.99,28.57 13.34,28.57
N$3  (via drill 0.5 pad 1.78)
  Top 0.508: IC701.1 137.16,69.85 v137.79,70.48
N$4
  Top 0.508: IC401.13 101.92,29.21 100.33,27.62 100.33,23.18 101.6,21.91 102.55,21.91 103.19,21.27 103.19,18.73 102.87,18.41 101.6,18.41
  Top 0.61: IC402.2 IC402.3 101.5,18.52 101.6,18.41
N$5  (via drill 0.5 pad 1.78)
  Top 0.508: IC701.2 135.89,69.85 Q701.2
  other vias: 135.25,70.48
N$6  (via drill 0.5 pad 3.81)
  Top 0.508: IC701.3 134.62,67.63 132.72,69.53
  Top 0.61: 132.72,69.53 132.72,71.75
  Top 0.813: G701.+ v140.97,73.66 134.62,73.66 132.72,71.75
  Bottom 0.61: v140.97,73.66 v140.97,63.5
N$7  (via drill 0.5 pad 2.18)
  Top 0.61: IC702.3 R703.1
  Bottom 0.61: SJ701.1 IC702.3
  other vias: 109.86,71.12
N$8  (via drill 0.5 pad 2.18)
  Top 0.61: IC702.2 R704.1
  Bottom 0.61: SJ702.1 IC702.2
  other vias: 109.86,68.58
N$9  (via drill 0.5 pad 2.18)
  Top 0.61: IC702.1 R705.1
  Bottom 0.61: SJ703.1 IC702.1
  other vias: 109.86,66.04
N$10  (via drill 0.5 pad 1.68)
  Top 0.508: IC201.19 83.44,49.28 85.34,49.28 Q202.1
  Top 0.813: C209.2 Q202.1 v85.72,48.77
N$11  (via drill 0.5 pad 1.68)
  Top 0.508: IC201.18 83.81,48.51 84.07,48.51 85.72,46.86 v85.72,46.48 85.85,46.35 Q202.2
  Top 0.813: 85.85,46.35 C208.2
N$12  (via drill 0.5 pad 3.81)
  other vias: 140.97,60.96
N$13  (via drill 0.5 pad 3.81)
  other vias: 140.97,76.2
N$14
  Top 0.813: C607.2 136.53,11.56 RJ601.M1
N$15
  Top 0.813: C608.2 117.47,14.86 RJ601.M2
N$16  (via drill 0.5 pad 3.05)
  other vias: 119.13,13.21
N$17  (via drill 0.5 pad 3.05)
  other vias: 134.87,13.21
N$21  (via drill 0.5 pad 3.81)
  other vias: 6.5,90
N$22  (via drill 0.5 pad 3.81)
  other vias: 121.28,10.16
N$23  (via drill 0.5 pad 3.81)
  other vias: 132.72,10.16
N$40
  Top 0.508: TVS402.2 97.58,13.87 97.16,14.29 97.16,17.14 96.52,17.78 IC402.7
  Top 0.61: R401.1 97.58,11.06 TVS402.2 TVS401.1
N$42
  Top 0.61: R408.2 89.53,10.79 90.81,9.53 X401.1
N$44  (via drill 0.5 pad 2.18)
  Top 1.016: C112.+ C102.1
  Top 1.27: C104.1 32.52,58.92 31.47,59.97 IC101.1 | C104.1 37.97,58.92 v38.1,59.05 | C112.+ 27.3,52.7 32.38,52.7 33.66,53.98 C104.1
  Bottom 1.27: v38.1,59.05 C103.+ | D101.C 20.81,46.21 C112.+
N$48  (via drill 0.5 pad 3.81)
  other vias: 143.5,90
N$49  (via drill 0.5 pad 3.81)
  other vias: 10.5,15
N$50  (via drill 0.5 pad 3.81)
  other vias: 139.5,15
N$58
  Top 0.508: IC401.14 101.92,30.48 99.38,27.94 99.38,22.86 101.5,20.74 IC402.4
N$60
  Top 0.508: IC201.23 85.52,55.88 87.63,55.88 Q201.2
  Top 1.016: C202.2 89.17,54.81 Q201.2
N$61
  Top 0.508: IC201.24 85.29,56.78 Q201.1
  Top 1.016: C203.2 85.29,58.69 Q201.1
N$64
  Top 0.381: IC502.23 39.08,28.28 40.01,29.21
  Top 0.508: 40.01,29.21 43.81,29.21 45.4,27.62 45.4,7.94 45.72,7.62 45.72,5.71 LED501.K
N$65
  Top 0.381: IC502.22 39.7,27.63 40.32,28.26
  Top 0.508: 40.32,28.26 43.5,28.26 44.45,27.3 44.45,7.94 43.81,7.3 LED502.K
N$66  (via drill 0.5 pad 2.18)
  Top 0.61: IC103.3 38.73,48.26 R104.2
  other vias: 39.37,48.9
N$67
  Top 0.813: R502.2 LED501.A
N$68
  Top 0.813: R503.2 LED502.A
N$69  (via drill 0.5 pad 3.81)
  Top 0.406: v27.62,9.84 27.62,9.7 X501.M2 | X501.M1 39.67,9.83 v39.69,9.84
  Top 0.813: X501.M2 27.64,7.79 C504.1
  Bottom 0.813: X501.M2 X501.M1
N$70
  Top 0.406: IC502.1 28.36,31.53 27.94,31.11
  Top 0.61: IC501.7 27.3,30.48 27.94,31.11
N$71
  Top 0.406: IC502.5 28.22,28.93 27.94,29.21
  Top 0.61: IC501.6 27.94,29.21
N$72  (via drill 0.5 pad 2.18)
  Top 0.508: 41.91,42.55 46.99,42.55 | 46.99,47.62 44.45,47.62
  Top 0.61: 46.99,47.62 47.31,47.31 47.31,42.86 46.99,42.55 | 41.91,42.55 41.27,41.91 37.47,41.91 35.56,43.81 34.92,43.81 | R101.1 C113.1 | 44.45,47.62 43.81,47.62 42.55,48.9 R104.3
  Top 0.813: R101.1 34.92,43.81
  other vias: 41.91,48.9
N$77
  Top 0.508: IC402.1 102.87,16.51 104.14,17.78 104.14,21.59 102.87,22.86 101.92,22.86 101.28,23.5 101.28,27.3 101.92,27.94 IC401.12
N$78  (via drill 0.5 pad 1.78)
  Top 0.406: IC502.16 36.33,23.73 35.89,23.29 35.89,22.48 | X501.2 34.91,14.46 v34.92,14.48
  Top 0.508: 35.89,22.48 36.7,21.67 36.7,15.11 35.99,14.4
  Top 0.813: X501.2 35.99,14.4
N$79  (via drill 0.5 pad 1.78)
  Top 0.406: 37.28,22.71 IC502.15 | v34.92,12.32 34.92,12.38 X501.3
  Top 0.508: 37.28,22.71 37.52,22.48 37.52,13.39 36.53,12.4
  Top 0.813: X501.3 36.53,12.4
N$81
  Top 0.61: IC103.2 40.01,46.67 40.49,47.16 42.38,47.16 43.33,46.2 R105.2 R102.1
N$85  (via drill 0.5 pad 1.68)
  Top 0.508: RJ601.8 121.92,19.68 C605.2
  other vias: 122.56,19.05
N$88  (via drill 0.5 pad 1.78)
  Top 0.406: 123.83,18.16 123.83,19.94
  Top 0.508: RJ601.7 123.83,18.16 | 123.83,19.94 C602.2
  other vias: 123.83,16.51
N$93
  Top 0.508: TVS402.1 99.28,13.44 98.11,14.61 98.11,17.46 96.52,19.05 IC402.6
  Top 0.61: R407.1 99.28,11.06 TVS402.1 TVS403.2
N$95  (via drill 0.5 pad 1.93)
  Top 0.406: v122.94,6.1 RJ601.11
  Top 0.508: R611.2 123.95,7.14 RJ601.11
N$97  (via drill 0.5 pad 1.93)
  Top 0.406: 133.6,5.97 132.08,4.45 130.81,4.45 129.54,5.71 128.91,5.71 128.27,6.35 R609.2
  Top 0.61: 133.6,5.97 v133.6,6.1
  Top 0.813: RJ601.9 v133.61,6.1 v133.6,6.1
N$100  (via drill 0.5 pad 2.18)
  Top 0.406: IC502.19 40.99,25.68 v41.27,25.4
  Bottom 0.61: v41.27,25.4 R501.2
N$112  (via drill 0.5 pad 2.18)
  Top 0.508: 108.74,3.96 108.43,3.96
  Top 0.61: v108.58,3.81 108.74,3.96
  Bottom 0.61: v108.58,3.81 108.58,5.08 109.22,5.71 109.86,5.71 111.12,6.99 111.12,7.47 R403.1
N$114  (via drill 0.5 pad 2.18)
  Top 0.508: IC601.3 116.7,46.22 115.06,44.58 Q601.1
  Top 0.61: Q601.1 114.17,44.45
  Top 0.813: C604.2 113.96,44.55 Q601.1
  other vias: 114.3,44.58
N$115  (via drill 0.5 pad 2.18)
  Top 0.508: IC601.2 116.81,47.02 114.43,49.4 Q601.3
  Top 0.61: 114.28,49.43 114.17,49.53
  Top 0.813: C606.2 114.28,49.43 Q601.3
  other vias: 114.3,49.4
N$127
  Top 0.406: IC502.17 38.23,24.38 39.14,23.47 39.14,21.95 C508.1
N$129  (via drill 0.5 pad 2.18)
  Top 0.61: SW401.6 111.12,7.47 R404.2
  other vias: 111.12,3.81
N$140  (via drill 0.5 pad 2.18)
  Top 0.61: R402.1 SW401.8
  other vias: 106.05,3.81
N$157
  Top 0.508: IC601.43 123.8,51.09 C609.2
N$158
  Top 0.508: IC601.11 118.97,39.81 R610.2
N$163
  Top 0.508: R612.2 R610.1
N$165
  Top 0.508: IC601.35 130.2,51.41 130.81,52.07 R605.2
NA_WIRE_0  (1 unrouted)
  Top 0.508: IC201.43 68.93,47.62 70.48,47.62 72.71,49.85 | 72.71,49.85 74.93,52.07 74.93,52.94 IC201.33 | IC201.34 73.03,53.71 73.03,51.44 71.75,50.16 72.07,49.85 72.71,49.85
NET_LEDA  (via drill 0.5 pad 2.18)
  Top 0.508: IC601.10 117.13,40.62 116.52,40.01 116.52,31.43 v118.75,29.21 | v114.94,29.21 115.57,28.57 115.57,26.04 114.94,25.4 114.94,12.7 116.84,10.79 116.84,5.71 120.02,2.54 127.64,2.54 128.27,3.17 R609.1
  Bottom 0.508: v114.94,29.21 v118.75,29.21
NET_LEDB
  Top 0.508: IC601.9 116.66,41.41 115.57,40.32 115.57,31.11 116.84,29.84 116.84,26.02 115.88,25.06 115.88,13.02 118.11,10.79 118.11,5.71 119.38,4.45 125.73,4.45 R611.1
PE3_INT3_VCC_FAILURE  (via drill 0.5 pad 2.18)
  Top 0.508: IC201.5 81.28,34.14 81.28,25.4 80.01,24.13 v79.69,24.13
  Top 0.61: IC103.7 40.01,38.73 40.64,38.1 41.91,38.1 42.55,38.73 v44.45,38.73 48.58,38.73 49.85,40.01 R103.1
  Bottom 0.61: v44.45,38.73 57.78,25.4 78.11,25.4 79.38,24.13 v79.69,24.13
PE4_INT4_GRIPER_IS_CLOSE  (via drill 0.5 pad 1.42, 0.5 pad 1.93, 0.5 pad 2.18)
  Top 0.508: IC201.6 82.23,34.32 82.23,23.18 v81.28,22.23 | C210.2 78.87,18.29 J201.1 | J201.1 R202.1 | J201.1 v80.01,18.41
  Bottom 0.508: J201.1 v80.01,18.41
  Bottom 0.61: v80.01,18.41 80.01,20.95 v81.28,22.23
  other vias: 78.74,18.41
PE5_INT5
  Top 0.406: 77.47,16.51 77.47,20
  Top 0.508: IC201.7 83.19,34.5 83.19,21.27 82.55,20.64 78.11,20.64 77.47,20 | SV202.9 79.69,14.29 77.79,14.29 77.47,14.61 77.47,16.51
PE6_INT6  (via drill 0.5 pad 2.18)
  Top 0.508: SV202.10 84.45,10.79 84.45,12.06 v82.55,13.97 83.19,14.61 83.19,16.51 83.19,19.68 84.14,20.64 84.14,34.68 IC201.8
  Top 0.61: 83.19,16.51 R405.1
  Bottom 0.61: SW401.5 113.67,1.91 113.03,1.27 87,1.27 85.09,3.17 85.09,11.43 v82.55,13.97
RD+  (via drill 0.5 pad 1.93)
  Top 0.508: C602.1 R607.2 125.73,24.77 125.09,25.4 v125.09,26.04 | IC601.16 126.2,30.95 v125.09,29.84
  Bottom 0.508: v125.09,26.04 v125.09,29.84
RD-
  Top 0.508: C605.1 R608.2 120.02,24.77 123.19,27.94 125.73,27.94 127,29.21 IC601.17
RD_CT  (via drill 0.5 pad 1.68)
  Top 0.406: 125.22,15.75 125.22,17.27
  Top 0.508: R607.1 125.73,19.68 RJ601.6 125.09,17.4 125.22,17.27 | C603.2 R608.1 120.02,18.16 123.32,14.86 124.33,14.86 125.22,15.75
  other vias: 125.09,19.05
RESET  (via drill 0.5 pad 1.93, 0.5 pad 2.18)
  Top 0.508: 95.7,50.3 92.84,50.3 92.08,49.53 90.81,49.53 90.17,50.16 83.2,50.16 IC201.20 80.64,47.61 80.64,44.45 73.66,37.47 73.66,34.92 75.17,33.41 arc-45 75.25,33.23 75.25,30.8 76.2,29.84 v76.2,22.86
  Top 0.61: R201.1 96.36,50.95 95.7,50.3
  Top 0.813: v66.67,5.08 59.05,5.08 57.15,6.99 57.15,8.89 | C201.2 96.65,52.09 R201.1
  Top 2.184: SV201.6 57.15,8.89 SV201.8
  Bottom 0.61: v66.67,5.08 66.67,10.79 72.39,16.51 72.39,19.05 v76.2,22.86
RS485_DE  (via drill 0.5 pad 1.93, 0.5 pad 2.18)
  Top 0.508: IC201.4 79.69,34.6 v79.69,29.21 | R406.2 87,24.77 86.04,25.72 86.04,27.62 v87.63,29.21
  Top 0.61: v87.63,29.21 IC401.4
  Bottom 0.61: v79.69,29.21 v87.63,29.21
RS485_RXD  (via drill 0.5 pad 1.93, 0.5 pad 2.18)
  Top 0.508: IC201.2 76.52,35.51 76.52,31.11 78.03,29.6 arc-45 78.11,29.42 78.11,28.26 v79.69,26.67
  Top 0.61: IC401.5 90.81,27.94 90.49,28.26 89.22,28.26 v87.63,26.67
  Bottom 0.61: v79.69,26.67 v87.63,26.67
RS485_TXD  (via drill 0.5 pad 1.93)
  Top 0.508: IC201.3 78.11,35.05 v78.11,31.75
  Top 0.61: IC401.3 90.81,30.48 90.49,30.16 89.22,30.16 v87.63,31.75
  Bottom 0.61: v78.11,31.75 v87.63,31.75
RXD1  (via drill 0.5 pad 2.18)
  Top 0.508: IC201.27 80.96,55.85 v80.96,60.64 | IC501.2 19.05,30.48 18.41,31.11 18.41,32.38 24.77,38.73 v27.94,38.73
  Bottom 0.508: v27.94,38.73 34.29,45.09 52.7,45.09 58.42,50.8
  Bottom 0.61: 58.42,50.8 73.66,50.8 80.96,58.1 v80.96,60.64
TCK  (via drill 0.5 pad 2.18)
  Top 0.406: 68.43,39.85 IC201.57
  Top 0.508: v56.52,15.88 55.24,17.14 55.24,28.57 57.78,31.11 59.69,31.11 68.43,39.85
  Top 0.813: SV201.1 51.44,12.06 v51.44,15.88
  Bottom 0.61: v51.44,15.88 v56.52,15.88
TD+  (via drill 0.5 pad 1.68)
  Top 0.508: RJ601.1 132.08,17.14 132.08,33.02 132.08,33.66 129.4,36.34 IC601.20
  Top 0.61: R604.2 RJ601.1
  other vias: 131.44,16.51
TD-  (via drill 0.5 pad 1.42, 0.5 pad 1.68, 0.5 pad 1.93)
  Top 0.508: RJ601.2 v130.18,26.67 R606.2 | v133.99,26.67 133.99,33.02 130.2,36.8 IC601.21
  Bottom 0.61: v130.18,26.67 v133.99,26.67
  other vias: 130.18,19.05
TD_CT  (via drill 0.5 pad 1.68)
  Top 0.508: RJ601.3 R601.2 C601.2
  other vias: 128.91,16.51
TDI  (via drill 0.5 pad 2.18)
  Top 0.508: v50.8,18.41 50.8,27.91 56.86,33.97 59.08,33.97 IC201.54
  Top 0.813: v59.05,18.41 59.69,17.78 59.69,13.34 60.96,12.06 SV201.9
  Bottom 0.61: v50.8,18.41 v59.05,18.41
TDO
  Top 0.508: SV201.3 53.34,29.21 57.15,33.02 59.26,33.02 IC201.55
TMS
  Top 0.508: SV201.5 54.29,13.02 54.29,28.89 57.47,32.07 59.44,32.07 IC201.56
TXD1  (via drill 0.5 pad 2.18)
  Top 0.508: IC201.28 79.69,55.71 79.69,58.1 v79.06,58.74 | IC501.3 19.05,29.21 17.46,30.8 17.46,32.7 26.04,41.27 v27.94,41.27
  Bottom 0.508: v27.94,41.27 33.02,46.35 52.07,46.35 57.78,52.07 58.42,52.07
  Bottom 0.61: 58.42,52.07 72.39,52.07 v79.06,58.74
USB_5V  (via drill 0.5 pad 1.78, 0.5 pad 2.18)
  Top 0.406: X501.1 32.41,14.46 v32.38,14.48
  Top 0.813: X501.1 32.41,15.26 v34.92,17.78 35.05,17.91 C505.1
VCC
  Top 0.61: SV304.6 82.55,83.82 80.64,83.82 73.03,76.2 IC302.9 73.03,72.39 73.03,71.12 | 73.03,71.12 85.72,71.12 | 85.72,71.12 97.79,71.12 98.42,71.75 98.42,72.39 | 98.42,72.39 IC304.9 98.42,75.25 99.38,76.2 110.81,76.2 115.89,81.28 132.08,81.28 | 85.72,71.12 85.72,72.39 IC303.9 | 73.03,71.12 60.96,71.12 60.33,71.75 60.33,72.39 IC301.9 | C304.1 100.2,72.39 | 87.5,72.39 C303.1 | 74.8,72.39 C302.1 | 62.1,72.39 C301.1 | 98.42,72.39 98.56,72.52
  Top 0.813: 85.72,72.39 87.5,72.39 | 73.03,72.39 74.8,72.39 | 60.33,72.39 62.1,72.39 | 98.56,72.52 C304.1
  Top 1.27: C111.+ C101.1
  Top 2.184: SV301.6 SV301.5 20.95,92.71 | 20.95,92.71 42.55,92.71 | 42.55,92.71 64.14,92.71 | 64.14,92.71 85.72,92.71 | 85.72,92.71 107.31,92.71 | 107.31,92.71 128.91,92.71 | SV306.6 SV306.5 128.91,92.71 | SV305.6 SV305.5 107.31,92.71 | SV304.5 SV304.6 85.72,92.71 | SV303.5 SV303.6 64.14,92.71 | 42.55,92.71 SV302.5 SV302.6 | 20.95,92.71 13.97,92.71 11.43,90.17 11.43,87.63 C111.+ 6.35,53.34 12.7,46.99 T101.3 12.7,41.27 | 128.91,92.71 134.62,92.71 137.16,90.17 137.16,86.36 132.08,81.28
  Bottom 0.61: C111.+ 6.35,53.34 8.26,51.44 17.78,51.44 18.41,50.8 D101.A

## Text on the board
Bottom: 01.01.2014